# EAGLE design LB_BIT_i11_PRESSURESENSOR-v02(rev1) (EAGLE 6.6.0)
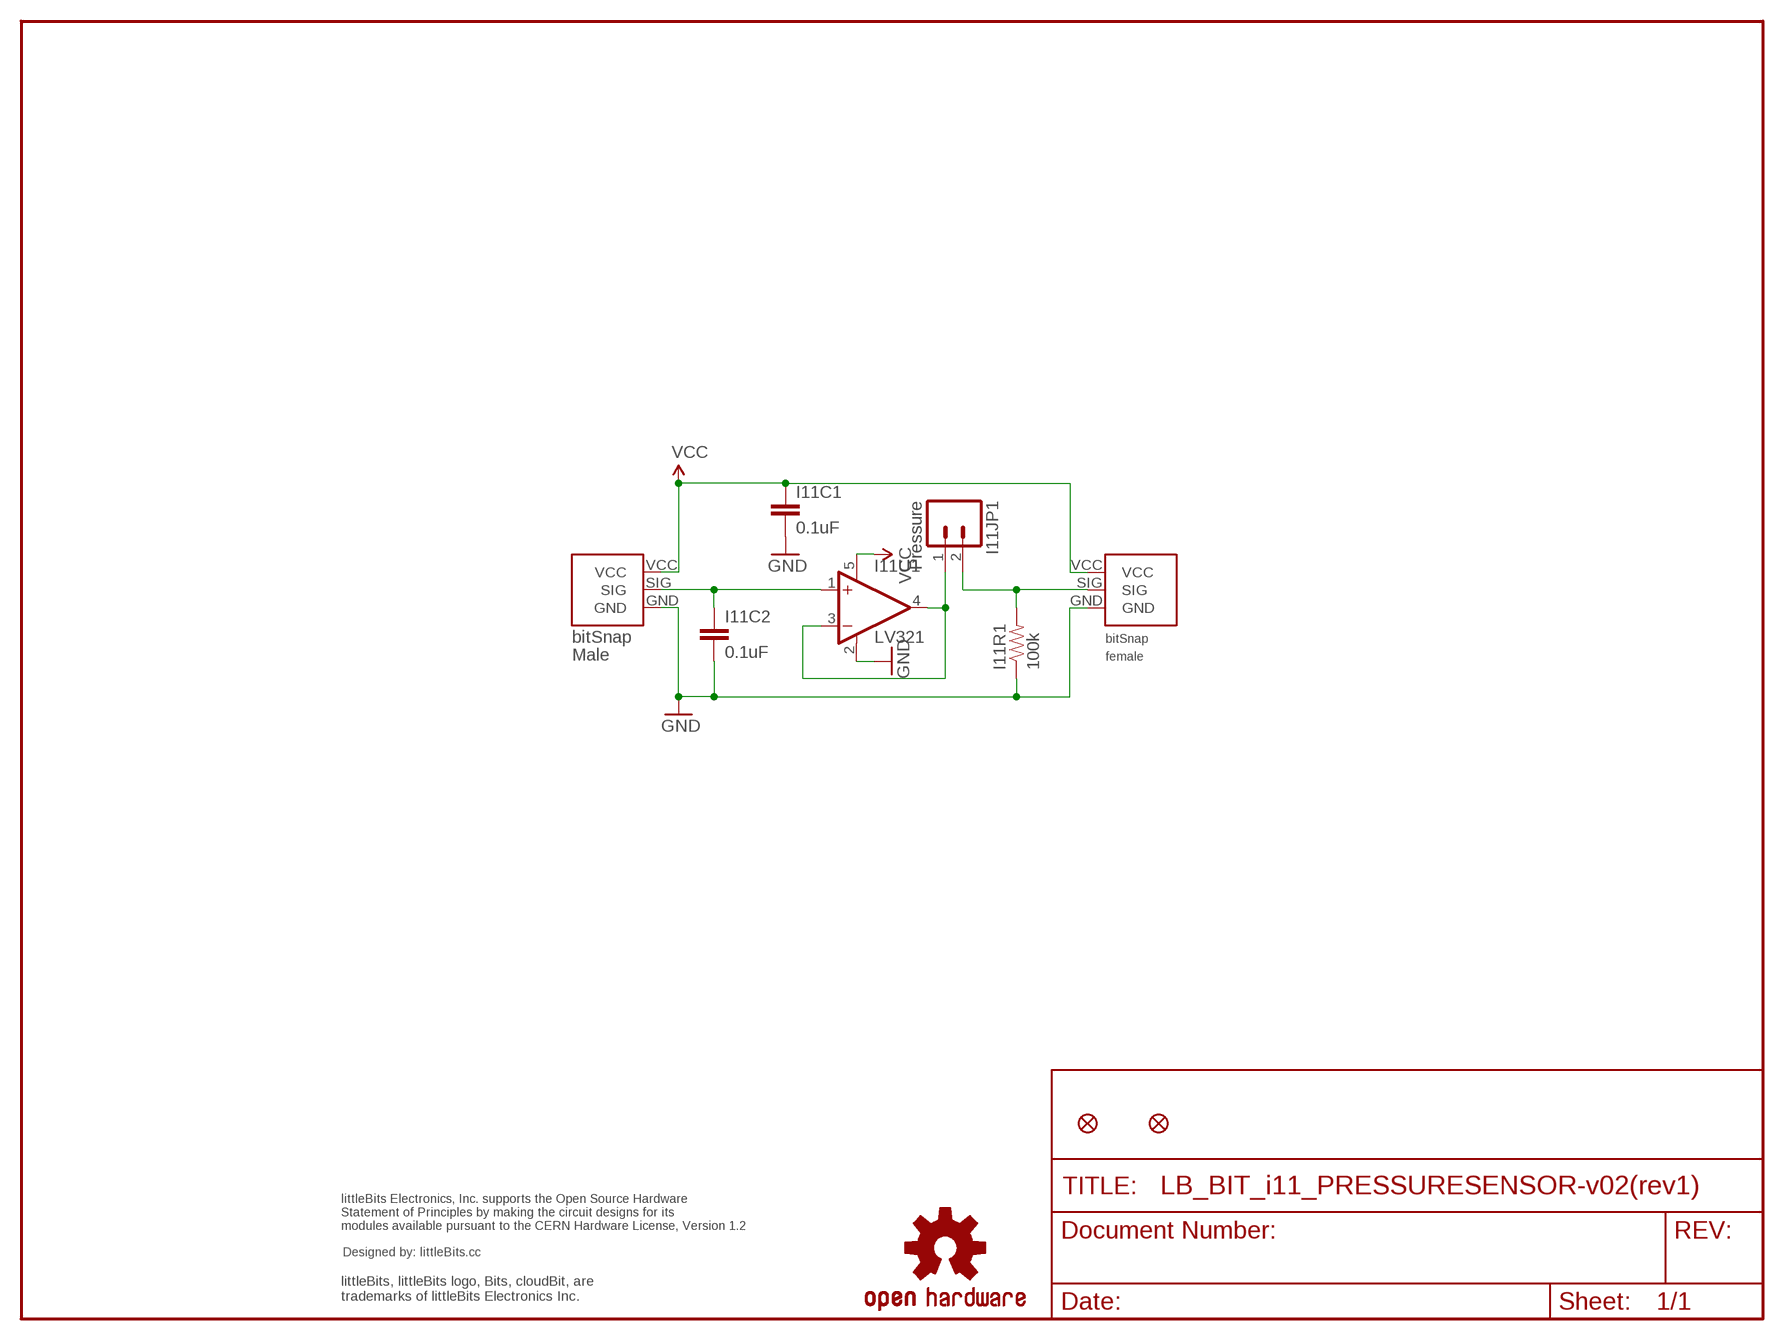
[diagram p0: schematic, sheet 1]

## Parts
I11BSF  BITSNAP_FEMALE  [BITSNAP_FEMALE]
I11BSM  BITSNAP_MALE  [BITSNAP_MALE]
I11C1  0.1uF  CAP0603-CAP  [0603-CAP]
I11C2  0.1uF  CAP0603-CAP  [0603-CAP]
I11JP1  Pressure  M02PTH  [1X02]
I11R1  100k  RESISTOR0603-RES  [0603-RES]
I11U1  LV321  [SC70-5]
JP2  FIDUCIAL1X2.5  [FIDUCIAL-1X2.5]
JP3  FIDUCIAL1X2.5  [FIDUCIAL-1X2.5]
U$1  OSHWCREDIT  [OSHWCREDIT]
U$4  OSHW-LOGOL  [OSHW-LOGO-L]

## Nets
GND: I11BSF.GND I11BSM.GND I11C1.2 I11C2.2 I11R1.1 I11U1.2(V-)
N$6: I11JP1.1 I11U1.3(-IN) I11U1.4(OUT)
PS: I11BSF.SIG I11JP1.2 I11R1.2
SIG: I11BSM.SIG I11C2.1 I11U1.1(+IN)
VCC: I11BSF.VCC I11BSM.VCC I11C1.1 I11U1.5(V+)

## Library data of the parts
I11BSF = bitSnap:BITSNAP_FEMALE
I11BSM = bitSnap:BITSNAP_MALE
I11C1 I11C2 = SparkFun:CAP: Capacitor Standard 0603 ceramic capacitor, and 0.1" leaded capacitor.
I11JP1 = SparkFun:M02: Header 2 Standard 2-pin 0.1" header. Use with straight break away headers (SKU : PRT-00116), right angle break away headers (PRT-00553), swiss pins (PRT-00743), machine pins (PRT-00117), and female headers (PRT-00115). Molex polarized connector foot print use with SKU : PRT-08233 with associated crimp pins and housings.
I11R1 = SparkFun:RESISTOR: Resistor Basic schematic elements and footprints for 0603, 1206, and PTH 1/10th watt (small) resistors.
I11U1 = LITTLEBITS:LV321
JP2 JP3 = abes:FIDUCIAL: Fiducial Alignment Points Various fiducial points for machine vision alignment.
U$1 = LITTLEBITS:OSHWCREDIT
U$4 = SparkFun:OSHW-LOGO: Open Source Hardware Logo This logo indicates the piece of hardware it is found on incorporates a OSHW license and/or adheres to the definition of open source hardware found here: http://freedomdefined.org/OSHW

## Board
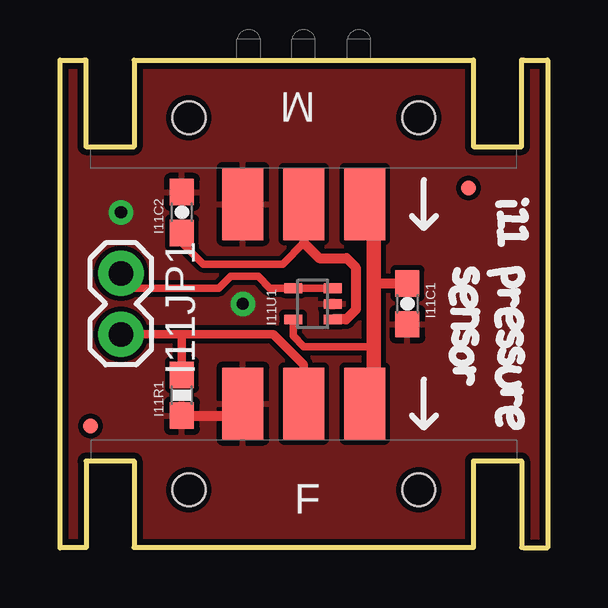
[diagram p1: board, top side]
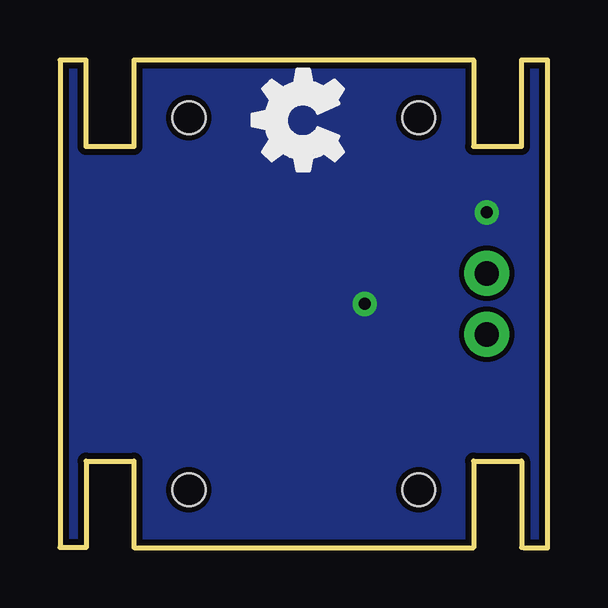
[diagram p2: board, bottom side, seen from below]

Size 20.32 x 20.33 mm. Coordinates in mm from the lower left corner, seen from the top.
Outline: 0,0 0,0.01
Outline: 0,0.01 0,20.33 1.02,20.33
Outline: 19.3,20.33 20.32,20.33 20.32,0.01 19.3,0.01
Outline: 1.02,0.01 0,0.01
Copper layers (1*16): Top 0.035mm / dielectric 1.5mm / Bottom 0.035mm
Design rules "default": minimum track width 8mil, minimum drill 20mil, track to track 8mil, track to pad 8mil, pad to pad 8mil, via to via 8mil, smd to smd 8mil, copper to edge 10mil, drill to drill 8mil, minimum pad ring 12mil, minimum via ring 10mil, stop-mask expansion 4mil, vias tented up to drill 25mil, thermal gap 10mil

### Footprints (pad centres in the part's own frame; a part is rotated, then mirrored left to right if it is on the bottom)
BITSNAP_FEMALE = smd 1.7 x 3: GND 6.35,6; SIG 8.89,6; VCC 11.43,6 | hole 1.37: 13.68,2.41; 4.1,2.41
BITSNAP_MALE = smd 1.7 x 3: GND 11.43,6; SIG 8.89,6; VCC 6.35,6 | hole 1.37: 13.68,2.41; 4.1,2.41
0603-CAP = smd 1.1 x 1: 1 -0.85,0; 2 0.85,0
1X02 = drill 1.016 pad 1.88: 1 0,0; 2 2.54,0
0603-RES = smd 1.1 x 1: 1 -0.85,0; 2 0.85,0
SC70-5 = smd 0.4 x 0.75: 1 -0.65,-0.825; 2 0,-0.825; 3 0.65,-0.825; 4 0.65,0.825; 5 -0.65,0.825
FIDUCIAL-1X2.5 = smd 0.635 x 0.635: 1 0,0

### Placement (x,y rotation side)
I11BSF  1.27,0.01 0 top
I11BSM  19.05,20.33 180 top
I11C1  14.48,10.17 270 top
I11C2  5.08,13.98 90 top
I11JP1  2.54,11.44 270 top
I11R1  5.08,6.36 90 top
I11U1  10.54,10.17 90 top
JP2  17.02,15 0 top
JP3  1.27,5.09 0 top
U$1  -20.32,-22.85 0 top  (outside the outline)
U$4  -16.51,-10.15 0 top  (outside the outline)
U$6  [OSHW_FILLX150_NOTEXT]  8.51,14.87 0 top

### Tracks (layer width: path | path; a pad name or v marks a point on that pad's centre or on a via)
GND  (via drill 0.51)
  Top 0.406: I11R1.1 7.62,5.51 I11BSF.GND
  other vias: 7.62,10.17 2.54,13.98
  pour Bottom: 0,20.33 0,0.01 20.32,0.01 20.32,20.33
  pour Top: 0,20.33 0,0.01 20.32,0.01 20.32,20.33
N$6
  Top 0.305: I11JP1.1 3.16,10.82 6.62,10.82 7.11,11.31 8.26,11.31 8.75,10.82 I11U1.4 I11U1.3
PS
  Top 0.356: I11JP1.2 5.08,8.9 | 5.08,8.9 8.89,8.9 10.16,7.63 I11BSF.SIG | 5.08,8.9 I11R1.2
SIG
  Top 0.305: I11C2.1 5.08,12.71 5.97,11.82 9.27,11.82 10.16,12.71 I11BSM.SIG
  Top 0.406: I11U1.1 11.92,9.52 12.32,9.92 12.32,11.69 11.94,12.07 10.79,12.07 10.16,12.71
VCC
  Top 0.305: I11U1.5 9.72,8.84 10.16,8.39 13.08,8.39
  Top 0.406: 13.08,11.02 I11C1.1
  Top 0.61: I11BSF.VCC 12.7,6.36 13.08,6.74 13.08,8.39 13.08,11.02 13.08,13.6 12.7,13.98 I11BSM.VCC